# Altium schematic sheet Capa.SchDoc: CONTROLADORA MAIS PIPOCA REV. D
size A3; Author: Marcos Aquino; DocumentNumber: 1; SheetNumber: 1; SheetTotal: 16
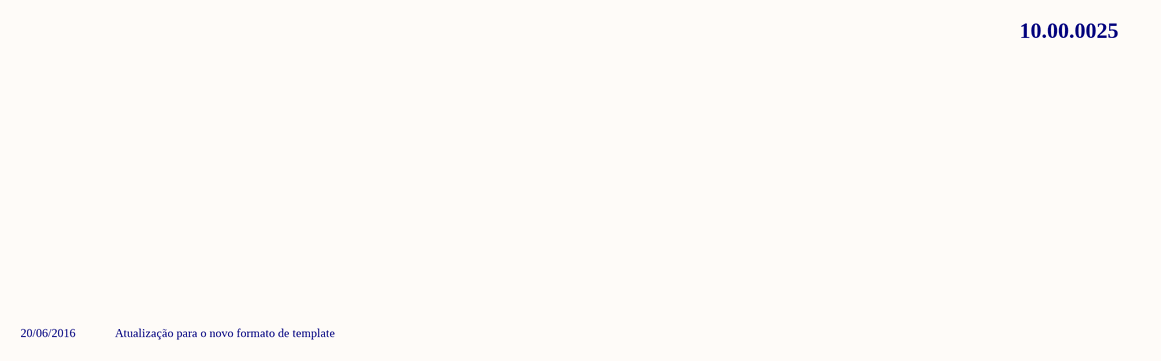
[diagram p0: Capa.SchDoc]

## Notes on the sheet
- 10.00.0025
- 20/06/2016
- Atualização para o novo formato de template
- Código
- Quark Tecnologia Eletrônica Ltda.
- Rua 216, nº 238 - Sala 01 - Meia Praia - Itapema/SC
- Observações
- (47) 3246-6352  -
- www.quarktee.com.br
- contato@quarktee.com.br
- Projeto
- Quantidade de Páginas
- Revisão
- Projetista
- Local arquivos no servidor
- Data
- Modificação
- Solicitador por:
- Executador por:
- Aprovado por: